# EAGLE schematic 2016VehicleInterface (EAGLE 7.6.0)
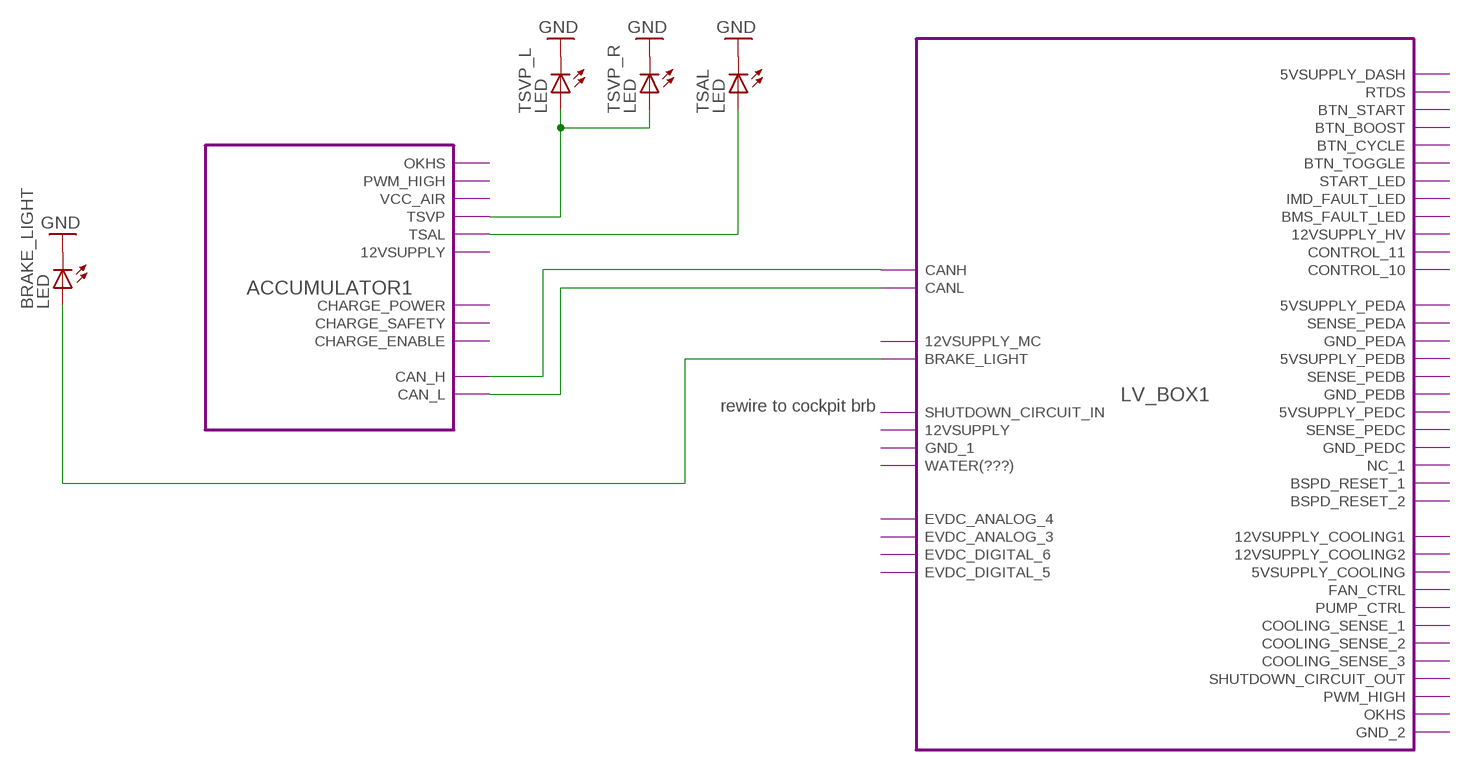
[diagram p0: schematic, sheet 1]

## Parts
BRAKE_LIGHT  LED  (no package)
TSAL  LED  (no package)
TSVP_L  LED  (no package)
TSVP_R  LED  (no package)

## Module instances
ACCUMULATOR1 = ACCUMULATOR
LV_BOX1 = LV_BOX

## Nets
GND: BRAKE_LIGHT.C TSAL.C TSVP_L.C TSVP_R.C
N$1: TSVP_L.A TSVP_R.A ; port ACCUMULATOR1.TSVP
N$2: TSAL.A ; port ACCUMULATOR1.TSAL
N$3: port LV_BOX1.CANH ACCUMULATOR1.CAN_H
N$4: port ACCUMULATOR1.CAN_L LV_BOX1.CANL
N$7: BRAKE_LIGHT.A ; port LV_BOX1.BRAKE_LIGHT

## Notes on the sheet
- rewire to cockpit brb

## Library data of the parts
BRAKE_LIGHT TSAL TSVP_L TSVP_R = HyTechSymbols:LED: Generic LED

## Module PEDAL_BOX
Ports: 12VSUPPLY_1(in) GND_2(in) CANL_2(io) CANH_2(io) CANL_1(io) CANH_1(io) 12VSUPPLY_2(out) GND_1(out) PED1_5V(out) PED2_5V(out) PED3_5V(out) PED1_SENSE(in) PED1_GND(in) PED2_SENSE(in) PED2_GND(in) PED3_SENSE(in) PED3_GND(in)

### Library data of the parts

## Module COOLING
Ports: 

### Library data of the parts

## Module POWER
Ports: OKHS(in) BMS_DISCHARGE_OK(in) SHUTDOWN_OUT(out) BRAKE_LIGHT(out) 12VSUPPLY_2(out) GND_2(in) CANL_2(io) CANH_2(io) GND(out) 12VSUPPLY(in) GND_1(in) 12VSUPPLY_1(out) CANL_1(io) CANH_1(io)

### Library data of the parts

## Module ACCUMULATOR
Ports: OKHS(out) PWM_HIGH(out) VCC_AIR(in) TSVP(out) TSAL(out) 12VSUPPLY(in) CHARGE_POWER(io) CHARGE_SAFETY(io) CHARGE_ENABLE(io) CAN_H(io) CAN_L(io)

### Library data of the parts

## Module LV_BOX
Ports: CANH(io) CANL(io) 12VSUPPLY_MC(out) BRAKE_LIGHT(out) WATER(???)(in) EVDC_ANALOG_4(in) EVDC_ANALOG_3(in) EVDC_DIGITAL_6(in) EVDC_DIGITAL_5(in) 5VSUPPLY_DASH(out) RTDS(out) BTN_START(in) BTN_BOOST(in) BTN_CYCLE(in) BTN_TOGGLE(in) START_LED(out) IMD_FAULT_LED(out) BMS_FAULT_LED(out) 12VSUPPLY_HV(out) CONTROL_11(io) CONTROL_10(io) 5VSUPPLY_PEDA(out) 5VSUPPLY_PEDB(out) 5VSUPPLY_PEDC(out) SENSE_PEDA(in) GND_PEDA(in) SENSE_PEDB(in) GND_PEDB(in) SENSE_PEDC(in) GND_PEDC(in) NC_1(nc) BSPD_RESET_1(io) BSPD_RESET_2(io) SHUTDOWN_CIRCUIT_IN(in) 12VSUPPLY_COOLING1(out) 12VSUPPLY_COOLING2(out) 5VSUPPLY_COOLING(out) FAN_CTRL(out) PUMP_CTRL(out) COOLING_SENSE_1(in) COOLING_SENSE_2(in) COOLING_SENSE_3(in) SHUTDOWN_CIRCUIT_OUT(out) PWM_HIGH(in) OKHS(in) GND_2(in) GND_1(in) 12VSUPPLY(in)
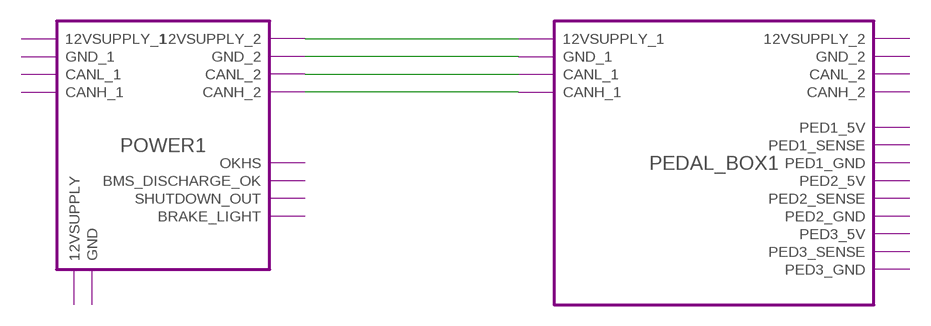
[diagram p1: schematic, module LV_BOX, sheet 1]

### Module instances
POWER1 = POWER
PEDAL_BOX1 = PEDAL_BOX

### Nets
N$1: port POWER1.12VSUPPLY_2 PEDAL_BOX1.12VSUPPLY_1
N$2: port PEDAL_BOX1.GND_1 POWER1.GND_2
N$3: port POWER1.CANL_2 PEDAL_BOX1.CANL_1
N$4: port PEDAL_BOX1.CANH_1 POWER1.CANH_2

### Library data of the parts